# Altium project 5V_PSU_Daniel_Eisen_rev0.PrjPcb
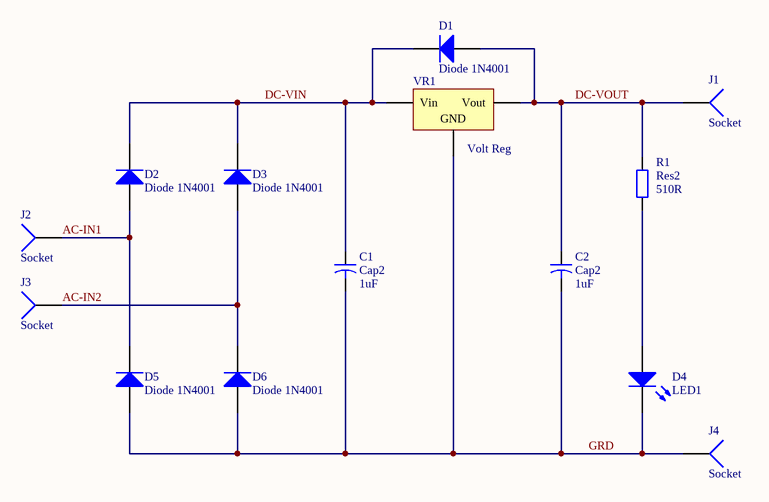
[diagram p0: 5V_PSU_Daniel_Eisen_rev0.SchDoc]
1 sheet, 14 parts. Net scope: global (net labels, ports and power ports of the same name join across sheets).
Board file: 5V_PSU_Daniel_Eisen_rev0.PcbDoc

## Sheet 5V_PSU_Daniel_Eisen_rev0.SchDoc
size A4

### Parts
C1  Cap2  value 1uF  [CAPR5-4X5]
C2  Cap2  value 1uF  [CAPR5-4X5]
D1  Diode 1N4001  [DO-41]
D2  Diode 1N4001  [DO-41]
D3  Diode 1N4001  [DO-41]
D4  LED1  [LED-1]
D5  Diode 1N4001  [DO-41]
D6  Diode 1N4001  [DO-41]
J1  Socket  [PIN1]
J2  Socket  [PIN1]
J3  Socket  [PIN1]
J4  Socket  [PIN1]
R1  Res2  value 510R  [AXIAL-0.4]
VR1  Volt Reg  [TO-220-AB]

### Nets
AC-IN1: D2.1(A) D5.2(K) J2.1
AC-IN2: D3.1(A) D6.2(K) J3.1
DC-VIN: C1.1 D1.2(K) D2.2(K) D3.2(K) VR1.1(Vin)
DC-VOUT: C2.1 D1.1(A) J1.1 R1.2 VR1.3(Vout)
GRD: C1.2 C2.2 D4.2(K) D5.1(A) D6.1(A) J4.1 VR1.2(GND)
NetD4_1: D4.1(A) R1.1

### Library data of the parts
C1 C2 = Cap2: Capacitor; Published: 23-Sep-2002; PackageReference: CAPR5-4X5; Publisher: Altium Limited; PackageDescription: Capacitor; 2 Leads
D1-D3 D5 D6 = Diode 1N4001: 1 Amp General Purpose Rectifier; Published: 8-Jun-2000; LatestRevisionDate: 17-Jul-2002; LatestRevisionNote: Re-released for DXP Platform.; DatasheetVersion: 1998; PackageVersion: Aug-1999; PackageReference: DO-41; Publisher: Altium Limited; PackageDescription: Diode, Axial; Body 5.2 x 2.7 mm (LxDia. max), Lead Dia. 0.86 mm (max); Code_JEDEC: DO-204-AL; ComponentLink1Description: Manufacturer Link; ComponentLink1URL: http://www.fairchildsemi.com/; ComponentLink2Description: Datasheet; ComponentLink2URL: http://www.fairchildsemi.com/ds/1N%2F1N4001.pdf
D4 = LED1: Typical RED GaAs LED; Published: 8-Jun-2000; LatestRevisionDate: 08-Jul-2005; LatestRevisionNote: Mech Layer 1 removed.; PackageReference: LED-1; Publisher: Altium Limited; PackageDescription: LED; 2 Leads
R1 = Res2: Resistor; Published: 8-Jun-2000; LatestRevisionDate: 17-Jul-2002; LatestRevisionNote: Re-released for DXP Platform.; PackageReference: AXIAL-0.4; Publisher: Altium Limited; PackageDescription: Axial Device, Thru-Hole; 2 Leads; 0.4 in Pin Spacing
VR1 = Volt Reg: Voltage Regulator; Published: 24-Mar-1999; LatestRevisionDate: 29-May-2009; LatestRevisionNote: IPC-7351 Footprint Added.; PackageReference: D2PAK; Publisher: Altium Limited; PackageDescription: 3-Pin Transistor Outline Package 2.54 mm Pitch, 15.1 mm Lead Span
J1-J4 = Socket: LatestRevisionDate: 17-Jul-2002; LatestRevisionNote: Re-released for DXP Platform.; Publisher: Altium Limited